# Altium project Battery Module.PrjPcb
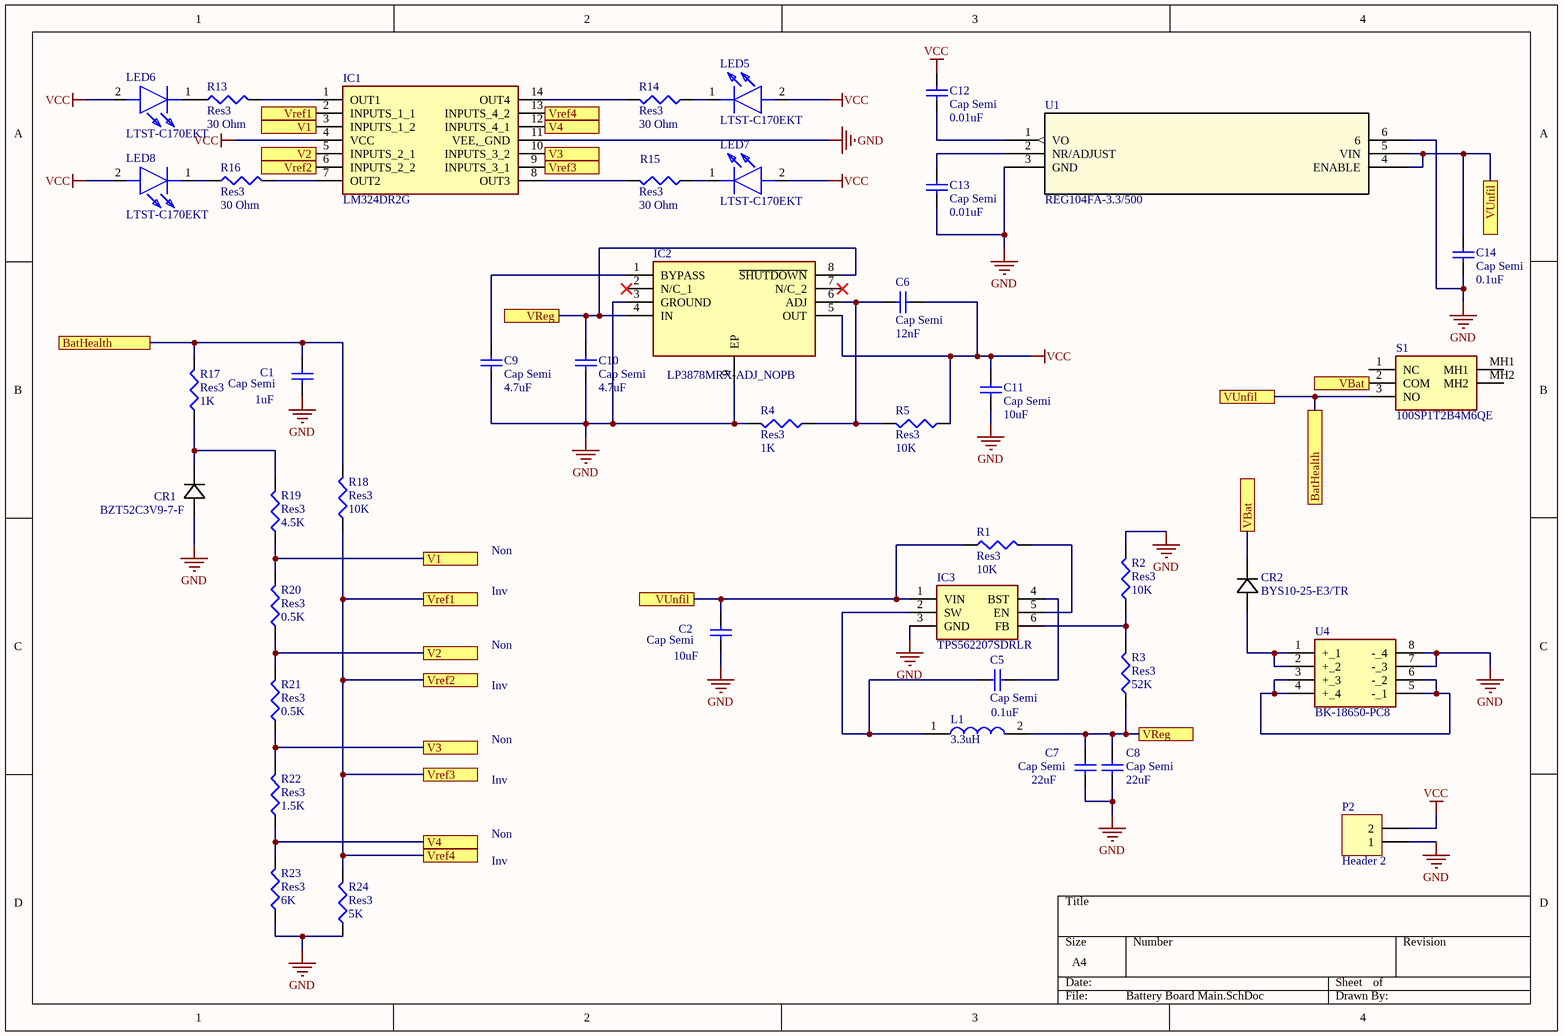
[diagram p0: Battery Board Main.SchDoc]
1 sheet, 43 parts. Net scope: flat (ports and power ports of the same name join across sheets).
Board file: Battery Board PCB.PcbDoc

## Sheet Battery Board Main.SchDoc
size A4; SheetNumber: 1; SheetTotal: 1

### Parts
C1  Cap Semi  value 1uF  [C1206]
C2  Cap Semi  value 10uF  [C1206]
C5  Cap Semi  value 0.1uF  [C1206]
C6  Cap Semi  value 12nF  [C1206]
C7  Cap Semi  value 22uF  [C1206]
C8  Cap Semi  value 22uF  [C1206]
C9  Cap Semi  value 4.7uF  [C1206]
C10  Cap Semi  value 4.7uF  [C1206]
C11  Cap Semi  value 10uF  [C1206]
C12  Cap Semi  value 0.01uF  [C1206]
C13  Cap Semi  value 0.01uF  [C1206]
C14  Cap Semi  value 0.1uF  [C1206]
CR1  BZT52C3V9-7-F  [SOD123_DIO]
CR2  BYS10-25-E3/TR  [DO-214AC_VIS]
IC1  LM324DR2G  [SOIC127P600X175-14N]
IC2  LP3878MRX-ADJ_NOPB  [SOIC127P600X170-9N]
IC3  TPS562207SDRLR  [SOTFL50P160X60-6N]
L1  3.3uH  [DFE2HCAH1R0MJ0L]
LED5  LTST-C170EKT  [LEDC2012X120N]
LED6  LTST-C170EKT  [LEDC2012X120N]
LED7  LTST-C170EKT  [LEDC2012X120N]
LED8  LTST-C170EKT  [LEDC2012X120N]
P2  Header 2  [HDR1X2]
R1  Res3  value 10K  [J1-0603]
R2  Res3  value 10K  [J1-0603]
R3  Res3  value 52K  [J1-0603]
R4  Res3  value 1K  [J1-0603]
R5  Res3  value 10K  [J1-0603]
R13  Res3  value 30 Ohm  [J1-0603]
R14  Res3  value 30 Ohm  [J1-0603]
R15  Res3  value 30 Ohm  [J1-0603]
R16  Res3  value 30 Ohm  [J1-0603]
R17  Res3  value 1K  [J1-0603]
R18  Res3  value 10K  [J1-0603]
R19  Res3  value 4.5K  [J1-0603]
R20  Res3  value 0.5K  [J1-0603]
R21  Res3  value 0.5K  [J1-0603]
R22  Res3  value 1.5K  [J1-0603]
R23  Res3  value 6K  [J1-0603]
R24  Res3  value 5K  [J1-0603]
S1  100SP1T2B4M6QE  [100SP1T2B4M6QE]
U1  REG104FA-3.3/500  [KTT5_TEX]
U4  BK-18650-PC8  [DIPS5561W300P1930L7884H2204Q8N]

### Ports
BatHealth, V1, V2, V3, V4, VBat, Vref1, Vref2, Vref3, Vref4, VReg, VUnfil

### Nets
GND: C1.2 C2.2 C7.1 C8.1 C9.2 C10.2 C11.2 C13.2 C14.2 CR1.2 IC1.11(VEE,_GND) IC2.3(GROUND) IC2.9(EP) IC3.3(GND) P2.1 R2.2 R4.2 R23.1 R24.1 U1.3(GND) U1.6 U4.7(-_3) U4.8(-_4)
VCC: C6.2 C11.1 C12.1 IC1.4(VCC) IC2.5(OUT) LED5.2(A) LED6.2(A) LED7.2(A) LED8.2(A) P2.2 R5.1
NetC1_1: C1.1 C2.1 C14.1 IC3.1(VIN) R1.1 R17.2 R18.2 S1.3(NO) U1.4(ENABLE) U1.5(VIN) ; port VUnfil, port BatHealth
NetC5_1: C5.1 IC3.2(SW) L1.1
NetC5_2: C5.2 IC3.4(BST)
NetC6_1: C6.1 IC2.6(ADJ) R4.1 R5.2
NetC7_2: C7.2 C8.2 C10.1 IC2.4(IN) IC2.8(~{SHUTDOWN}) L1.2 R3.1 ; port VReg
NetC9_1: C9.1 IC2.1(BYPASS)
NetC12_2: C12.2 U1.1(VO)
NetC13_1: C13.1 U1.2(NR/ADJUST)
NetCR1_1: CR1.1 R17.1 R19.2
NetCR2_1: CR2.1 S1.2(COM) ; port VBat
NetCR2_2: CR2.2 U4.1(+_1) U4.2(+_2)
NetIC1_1: IC1.1(OUT1) R13.2
NetIC1_2: IC1.2(INPUTS_1_1) IC1.6(INPUTS_2_2) IC1.9(INPUTS_3_1) IC1.13(INPUTS_4_2) R18.1 R24.2 ; port Vref1, port Vref2, port Vref3, port Vref4
NetIC1_3: IC1.3(INPUTS_1_2) R19.1 R20.2 ; port V1
NetIC1_5: IC1.5(INPUTS_2_1) R20.1 R21.2 ; port V2
NetIC1_7: IC1.7(OUT2) R16.2
NetIC1_8: IC1.8(OUT3) R15.2
NetIC1_10: IC1.10(INPUTS_3_2) R21.1 R22.2 ; port V3
NetIC1_12: IC1.12(INPUTS_4_1) R22.1 R23.2 ; port V4
NetIC1_14: IC1.14(OUT4) R14.2
NetIC3_5: IC3.5(EN) R1.2
NetIC3_6: IC3.6(FB) R2.1 R3.2
NetLED5_1: LED5.1(K) R14.1
NetLED6_1: LED6.1(K) R13.1
NetLED7_1: LED7.1(K) R15.1
NetLED8_1: LED8.1(K) R16.1
NetU4_3: U4.3(+_3) U4.4(+_4) U4.5(-_1) U4.6(-_2)

Not connected (* = marked no-connect by the designer): IC2 2(N/C_1)* 7(N/C_2)*; S1 1(NC) MH1 MH2

### Notes on the sheet
- Non
- Inv

### Library data of the parts
C1 C2 C5-C14 = Cap Semi: Capacitor (Semiconductor SIM Model); Published: 8-Jun-2000; LatestRevisionDate: 29-May-2009; LatestRevisionNote: IPC-7351 Footprint Added.; PackageReference: C1206; Publisher: Altium Limited; PackageDescription: Chip Capacitor
CR1 = BZT52C3V9-7-F: No Description Available; Mfr_Name: Diodes Inc; Type: DEV; Copyright: Copyright (C) 2022 Ultra Librarian. All rights reserved.; Manufacturer_Part_Number: BZT52C3V9-7-F; Digi-Key_Part_Number_1: BZT52C3V9-FDICT-ND; Digi-Key_Part_Number_2: BZT52C3V9-FDIDKR-ND; Digi-Key_Part_Number_3: BZT52C3V9-FDITR-ND; RefDes: RefDes
CR2 = BYS10-25-E3/TR: No Description Available; Mfr_Name: Vishay; Type: DEV; Copyright: Copyright (C) 2022 Ultra Librarian. All rights reserved.; Manufacturer_Part_Number: BYS10-25-E3/TR; Digi-Key_Part_Number_1: BYS10-25-E3/GICT-ND; Digi-Key_Part_Number_2: BYS10-25-E3/GIDKR-ND; Digi-Key_Part_Number_3: BYS10-25-E3/GITR-ND; RefDes: RefDes
IC1 = LM324DR2G: Integrated Circuit; Manufacturer_Name: onsemi; Datasheet Link: http://www.onsemi.com/pub/Collateral/LM324-D.PDF; Height: 1.75mm; Manufacturer_Part_Number: LM324DR2G; Mouser Part Number: 863-LM324DR2G; Mouser Price/Stock: https://www.mouser.co.uk/ProductDetail/onsemi/LM324DR2G?qs=2OtswVQKCOEcq0L2uFhs6w%3D%3D; Arrow Part Number: LM324DR2G; Arrow Price/Stock: https://www.arrow.com/en/products/lm324dr2g/on-semiconductor?region=europe
IC2 = LP3878MRX-ADJ_NOPB: Integrated Circuit; Manufacturer_Name: Texas Instruments; Manufacturer_Part_Number: LP3878MRX-ADJ/NOPB; Datasheet Link: http://www.ti.com/lit/gpn/lp3878-adj; Height: 1.7mm; Mouser2 Part Number: 926-LP3878MRXADJNOPB; Mouser2 Price/Stock: https://www.mouser.com/Search/Refine.aspx?Keyword=926-LP3878MRXADJNOPB
IC3 = TPS562207SDRLR: Integrated Circuit; Manufacturer_Name: Texas Instruments; Datasheet Link: https://www.ti.com/lit/gpn/tps562207s; Height: 0.6mm; Manufacturer_Part_Number: TPS562207SDRLR
L1 = DFE252012PD-4R7M=P2: Inductor; Manufacturer_Name: Murata Electronics; Datasheet Link: https://componentsearchengine.com//DFE252012PD-4R7M=P2.pdf; Height: 1.2mm; Mouser2 Part Number: 81-DFE252012PD4R7MP2; Mouser2 Price/Stock: https://www.mouser.com/Search/Refine.aspx?Keyword=81-DFE252012PD4R7MP2; Manufacturer_Part_Number: DFE252012PD-4R7M=P2
LED5-LED8 = LTST-C170EKT: LED; Manufacturer_Name: Lite-On; Datasheet Link: https://media.digikey.com/pdf/Data%20Sheets/Lite-On%20PDFs/LTST-C170EKT.pdf; Height: 1.2mm; Manufacturer_Part_Number: LTST-C170EKT; Mouser Part Number: 859-LTST-C170EKT; Mouser Price/Stock: https://www.mouser.co.uk/ProductDetail/Lite-On/LTST-C170EKT?qs=0hBTvMLoVZ04yIRvO1DUlw%3D%3D; Arrow Part Number: LTST-C170EKT; Arrow Price/Stock: https://www.arrow.com/en/products/ltst-c170ekt/lite-on-technology
P2 = Header 2: Header, 2-Pin; LatestRevisionDate: 17-Jul-2002; LatestRevisionNote: Re-released for DXP Platform.; Publisher: Altium Limited
R1-R5 R13-R24 = Res3: Resistor; Published: 8-Jun-2000; LatestRevisionDate: 29-May-2009; LatestRevisionNote: IPC-7351 Footprint Added.; PackageReference: J1-0603; Publisher: Altium Limited; PackageDescription: Chip Resistor
S1 = 100SP1T2B4M6QE: Switch; Manufacturer_Name: E-Switch; Datasheet Link: http://spec_sheets.e-switch.com/specs/T111069.pdf; Height: 6.86mm; Manufacturer_Part_Number: 100SP1T2B4M6QE; Mouser Part Number: 612-100-A2461; Mouser Price/Stock: https://www.mouser.co.uk/ProductDetail/E-Switch/100SP1T2B4M6QE?qs=rR7wk9eDIwq%252BdlBXTZsQkg%3D%3D
U1 = REG104FA-3.3/500: No Description Available; Mfr_Name: Texas Instruments; Copyright: Copyright (C) 2022 Ultra Librarian. All rights reserved.; Manufacturer_Part_Number: REG104FA-3.3/500; Digi-Key_Part_Number_1: 2156-REG104FA-3.3/500-ND; Digi-Key_Part_Number_2: 2156-REG104FA-3.3/500-TI-ND; Digi-Key_Part_Number_3: 296-REG104FA-3.3/500CT-ND; Digi-Key_Part_Number_4: 296-REG104FA-3.3/500DKR-ND; Digi-Key_Part_Number_5: 296-REG104FA-3.3/500TR-ND; Digi-Key_Part_Number_6: REG104FA-3.3CT-ND; Digi-Key_Part_Number_7: REG104FA-3.3DKR-ND; Digi-Key_Part_Number_8: REG104FA-3.3TR-ND; RefDes: RefDes; Type: DEV
U4 = BK-18650-PC8: Undefined or Miscellaneous; Manufacturer_Name: Memory Protection Devices; Datasheet Link: http://www.memoryprotectiondevices.com/datasheets/BK-18650-PC8-datasheet.pdf; Height: 22.04mm; Manufacturer_Part_Number: BK-18650-PC8